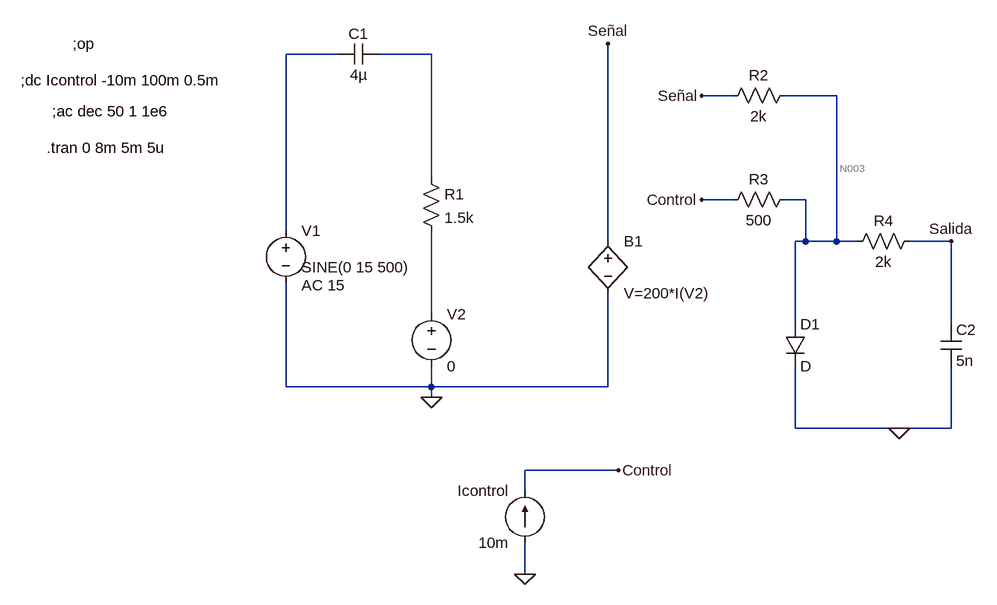
[diagram p0: schematic Draft1.asc]
Draft1.asc, the LTspice schematic file:
Version 4
SHEET 1 1076 680
WIRE 80 -192 0 -192
WIRE 224 -192 144 -192
WIRE 688 -128 640 -128
WIRE 848 -128 768 -128
WIRE 224 0 224 -192
WIRE 688 32 640 32
WIRE 800 32 768 32
WIRE 0 80 0 -192
WIRE 496 96 496 -208
WIRE 800 96 800 32
WIRE 800 96 784 96
WIRE 848 96 848 -128
WIRE 848 96 800 96
WIRE 880 96 848 96
WIRE 1024 96 960 96
WIRE 224 208 224 80
WIRE 784 224 784 96
WIRE 1024 224 1024 96
WIRE 0 320 0 160
WIRE 224 320 224 288
WIRE 224 320 0 320
WIRE 496 320 496 176
WIRE 496 320 224 320
WIRE 224 336 224 320
WIRE 784 384 784 288
WIRE 944 384 784 384
WIRE 1024 384 1024 288
WIRE 1024 384 944 384
WIRE 512 448 368 448
WIRE 368 480 368 448
WIRE 368 608 368 560
FLAG 224 336 0
FLAG 368 608 0
FLAG 944 384 0
FLAG 496 -208 Señal
FLAG 640 -128 Señal
FLAG 640 32 Control
FLAG 512 448 Control
FLAG 1024 96 Salida
SYMBOL voltage 0 64 R0
WINDOW 3 24 72 Left 2
WINDOW 123 24 100 Left 2
WINDOW 39 0 0 Left 2
SYMATTR InstName V1
SYMATTR Value SINE(0 15 500)
SYMATTR Value2 AC 15
SYMBOL voltage 224 192 R0
WINDOW 123 0 0 Left 2
WINDOW 39 0 0 Left 2
SYMATTR InstName V2
SYMATTR Value 0
SYMBOL cap 144 -208 R90
WINDOW 0 0 32 VBottom 2
WINDOW 3 32 32 VTop 2
SYMATTR InstName C1
SYMATTR Value 4µ
SYMBOL res 208 -16 R0
SYMATTR InstName R1
SYMATTR Value 1.5k
SYMBOL current 368 560 R180
WINDOW 0 24 80 Left 2
WINDOW 3 24 0 Left 2
WINDOW 123 0 0 Left 2
WINDOW 39 0 0 Left 2
SYMATTR InstName Icontrol
SYMATTR Value 10m
SYMBOL diode 768 224 R0
SYMATTR InstName D1
SYMBOL cap 1008 224 R0
SYMATTR InstName C2
SYMATTR Value 5n
SYMBOL res 784 -144 R90
WINDOW 0 0 56 VBottom 2
WINDOW 3 32 56 VTop 2
SYMATTR InstName R2
SYMATTR Value 2k
SYMBOL res 784 16 R90
WINDOW 0 0 56 VBottom 2
WINDOW 3 32 56 VTop 2
SYMATTR InstName R3
SYMATTR Value 500
SYMBOL res 976 80 R90
WINDOW 0 0 56 VBottom 2
WINDOW 3 32 56 VTop 2
SYMATTR InstName R4
SYMATTR Value 2k
SYMBOL bv 496 80 R0
SYMATTR InstName B1
SYMATTR Value V=200*I(V2)
TEXT -328 -208 Left 2 !;op
TEXT -408 -152 Left 2 !;dc Icontrol -10m 100m 0.5m
TEXT -360 -104 Left 2 !;ac dec 50 1 1e6
TEXT -368 -48 Left 2 !.tran 0 8m 5m 5u

The netlist it stands for:
* Draft1.asc
V1 N001 0 SINE(0 15 500) AC 15
V2 N004 0 0
C1 N002 N001 4µ
R1 N002 N004 1.5k
Icontrol 0 Control 10m
D1 N003 0 D
C2 Salida 0 5n
R2 N003 Señal 2k
R3 N003 Control 500
R4 Salida N003 2k
B1 Señal 0 V=200*I(V2)
.model D D
.lib standard.dio
;op
;dc Icontrol -10m 100m 0.5m
;ac dec 50 1 1e6
.tran 0 8m 5m 5u
.backanno
.end

* Results of the author's LTspice run, read from the files saved beside the schematic
* Operating Point, zero values left out:
*   V(control) = 5.714 V
*   V(n003) = 713.7 mV
*   V(salida) = 713.7 mV
*   I(B1) = 356.9 µA
*   I(D1) = 9.643 mA
*   I(Icontrol) = 10 mA
*   I(R3) = -10 mA
*   I(R2) = 356.9 µA
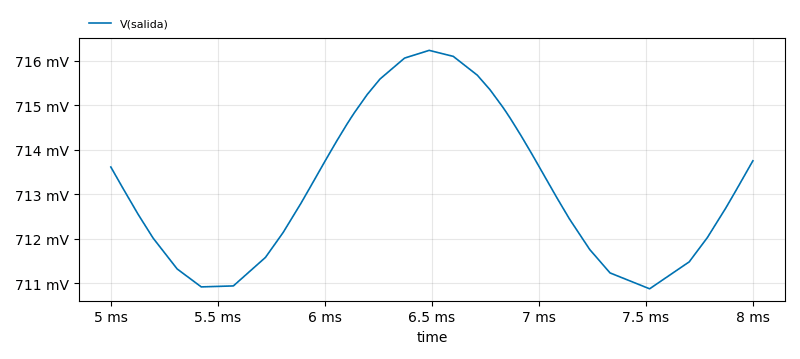
[diagram p1: Transient Analysis of Draft1.asc, plotted from the saved traces]
* Transient Analysis, 1 run:
*   V(salida): min 710.9 mV, max 716.2 mV, average 713.1 mV, rms 713.1 mV, last 713.8 mV